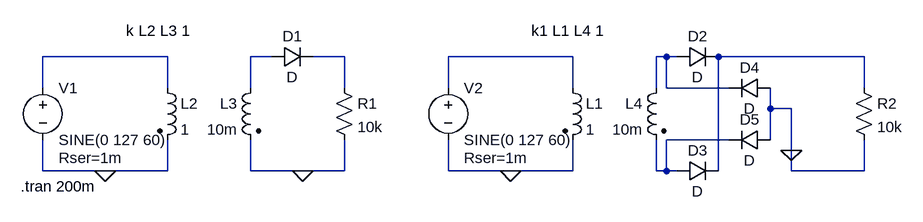
[diagram p0: schematic ex5.asc]
ex5.asc, the LTspice schematic file:
Version 4
SHEET 1 1088 680
WIRE -48 64 -240 64
WIRE 112 64 80 64
WIRE 224 64 176 64
WIRE 576 64 384 64
WIRE 720 64 704 64
WIRE 736 64 720 64
WIRE 1024 64 800 64
WIRE -240 112 -240 64
WIRE -48 112 -48 64
WIRE 80 112 80 64
WIRE 224 112 224 64
WIRE 384 112 384 64
WIRE 576 112 576 64
WIRE 704 112 704 64
WIRE 720 112 720 64
WIRE 816 112 720 112
WIRE 1024 112 1024 64
WIRE 880 144 880 112
WIRE 912 144 880 144
WIRE 816 192 720 192
WIRE 880 192 880 144
WIRE 912 208 912 144
WIRE -240 240 -240 192
WIRE -144 240 -240 240
WIRE -48 240 -48 192
WIRE -48 240 -144 240
WIRE 80 240 80 192
WIRE 160 240 80 240
WIRE 224 240 224 192
WIRE 224 240 160 240
WIRE 384 240 384 192
WIRE 480 240 384 240
WIRE 576 240 576 192
WIRE 576 240 480 240
WIRE 704 240 704 192
WIRE 720 240 720 192
WIRE 720 240 704 240
WIRE 736 240 720 240
WIRE 800 240 800 64
WIRE 912 240 912 208
WIRE 1024 240 1024 192
WIRE 1024 240 912 240
FLAG -144 240 0
FLAG 160 240 0
FLAG 480 240 0
FLAG 912 208 0
SYMBOL voltage -240 96 R0
WINDOW 123 0 0 Left 2
WINDOW 39 24 124 Left 2
SYMATTR SpiceLine Rser=1m
SYMATTR InstName V1
SYMATTR Value SINE(0 127 60)
SYMBOL ind2 -64 96 R0
SYMATTR InstName L2
SYMATTR Value 1
SYMATTR Type ind
SYMBOL ind2 96 96 M0
SYMATTR InstName L3
SYMATTR Value 10m
SYMATTR Type ind
SYMBOL res 208 96 R0
SYMATTR InstName R1
SYMATTR Value 10k
SYMBOL diode 112 80 R270
WINDOW 0 32 32 VTop 2
WINDOW 3 0 32 VBottom 2
SYMATTR InstName D1
SYMBOL voltage 384 96 R0
WINDOW 123 0 0 Left 2
WINDOW 39 24 124 Left 2
SYMATTR SpiceLine Rser=1m
SYMATTR InstName V2
SYMATTR Value SINE(0 127 60)
SYMBOL ind2 560 96 R0
SYMATTR InstName L1
SYMATTR Value 1
SYMATTR Type ind
SYMBOL ind2 720 96 M0
SYMATTR InstName L4
SYMATTR Value 10m
SYMATTR Type ind
SYMBOL res 1008 96 R0
SYMATTR InstName R2
SYMATTR Value 10k
SYMBOL diode 736 80 R270
WINDOW 0 32 32 VTop 2
WINDOW 3 0 32 VBottom 2
SYMATTR InstName D2
SYMBOL diode 736 256 R270
WINDOW 0 32 32 VTop 2
WINDOW 3 0 32 VBottom 2
SYMATTR InstName D3
SYMBOL diode 880 96 R90
WINDOW 0 0 32 VBottom 2
WINDOW 3 32 32 VTop 2
SYMATTR InstName D4
SYMBOL diode 880 176 R90
WINDOW 0 0 32 VBottom 2
WINDOW 3 32 32 VTop 2
SYMATTR InstName D5
TEXT -274 264 Left 2 !.tran 200m
TEXT -112 24 Left 2 !k L2 L3 1
TEXT 512 24 Left 2 !k1 L1 L4 1

The netlist it stands for:
* ex5.asc
V1 N001 0 SINE(0 127 60) Rser=1m
L2 N001 0 1
L3 N002 0 10m
R1 N003 0 10k
D1 N002 N003 D
V2 N004 0 SINE(0 127 60) Rser=1m
L1 N004 0 1
L4 N005 N007 10m
R2 N006 0 10k
D2 N005 N006 D
D3 N007 N006 D
D4 0 N005 D
D5 0 N007 D
.model D D
.lib standard.dio
.tran 200m
k L2 L3 1
k1 L1 L4 1
.backanno
.end